# EasyEDA Pro project ProPrj_M-power_2025-07-25.epro, schematic 电源

## Sheets
1 功率: Board Name: Board1; Create Date: 2025-06-16; Page Name: 功率; Project Name: M-power; Schematic Name: 电源; Update Date: 2025-07-17; Company: 嘉立创EDA; Page Size: A4; Version: V1.1
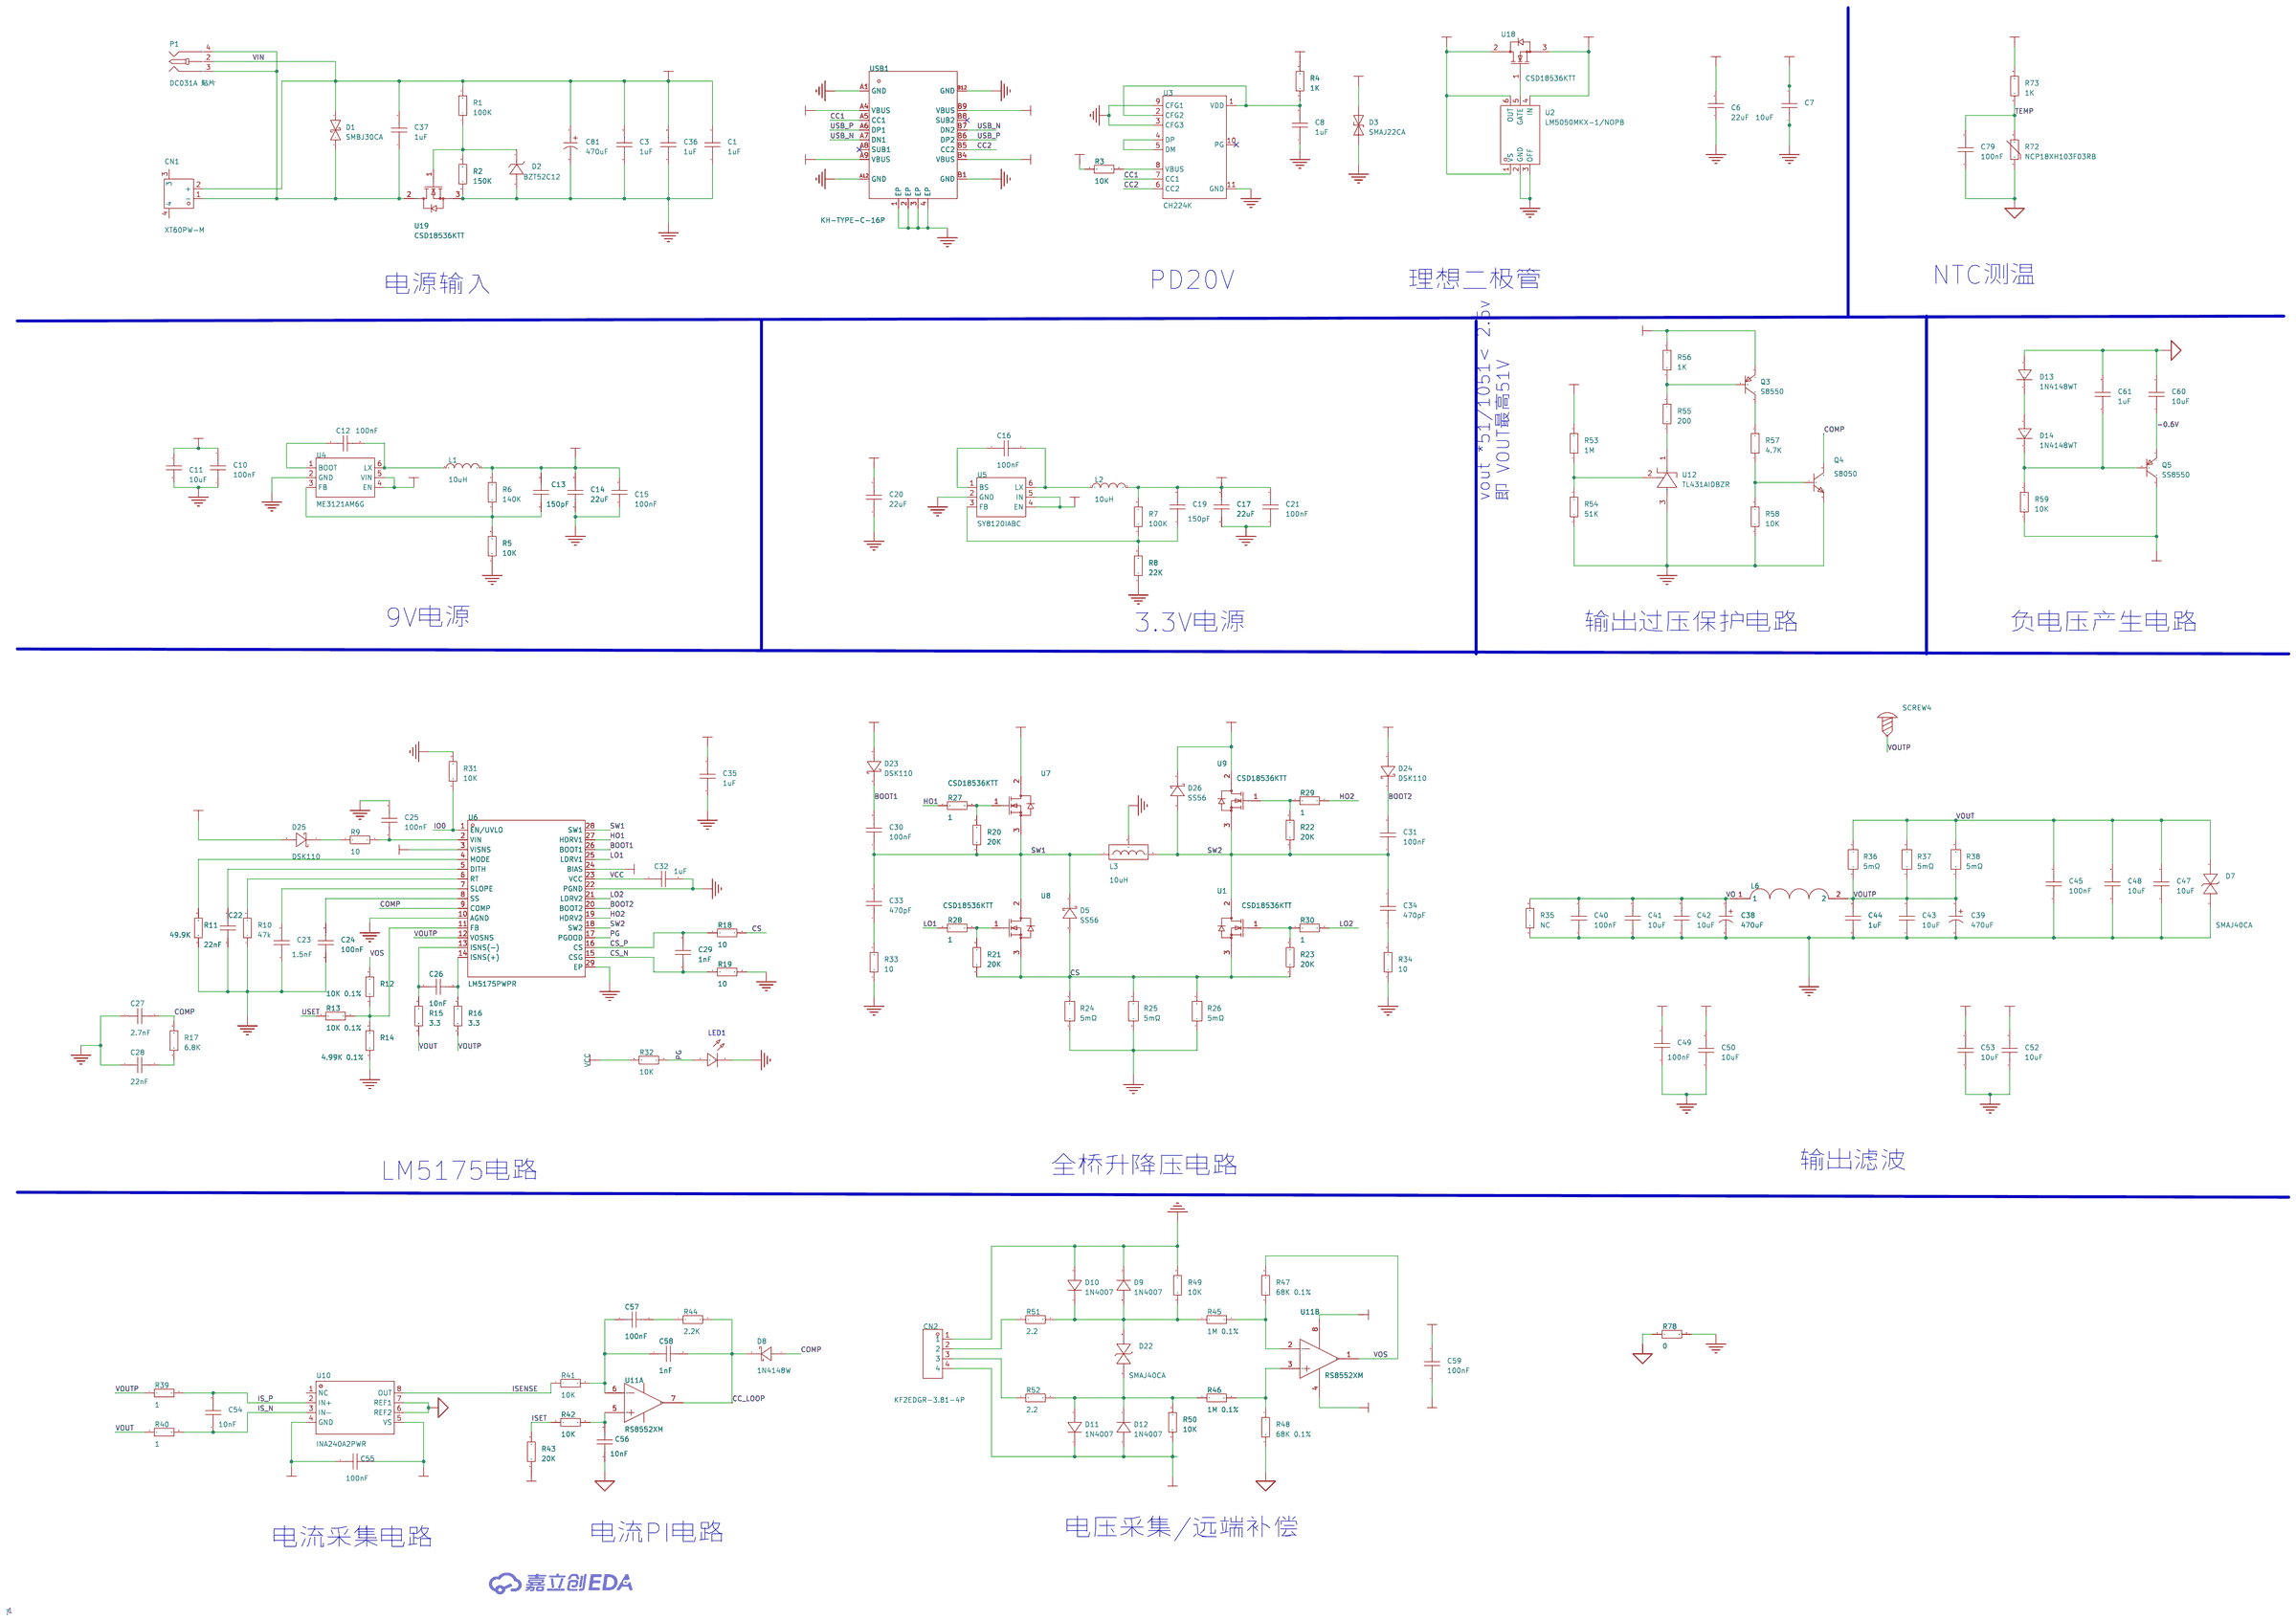
[diagram p0: 功率]
2 控制: Page Name: 控制; Update Date: 2025-07-18; Version: V1.0
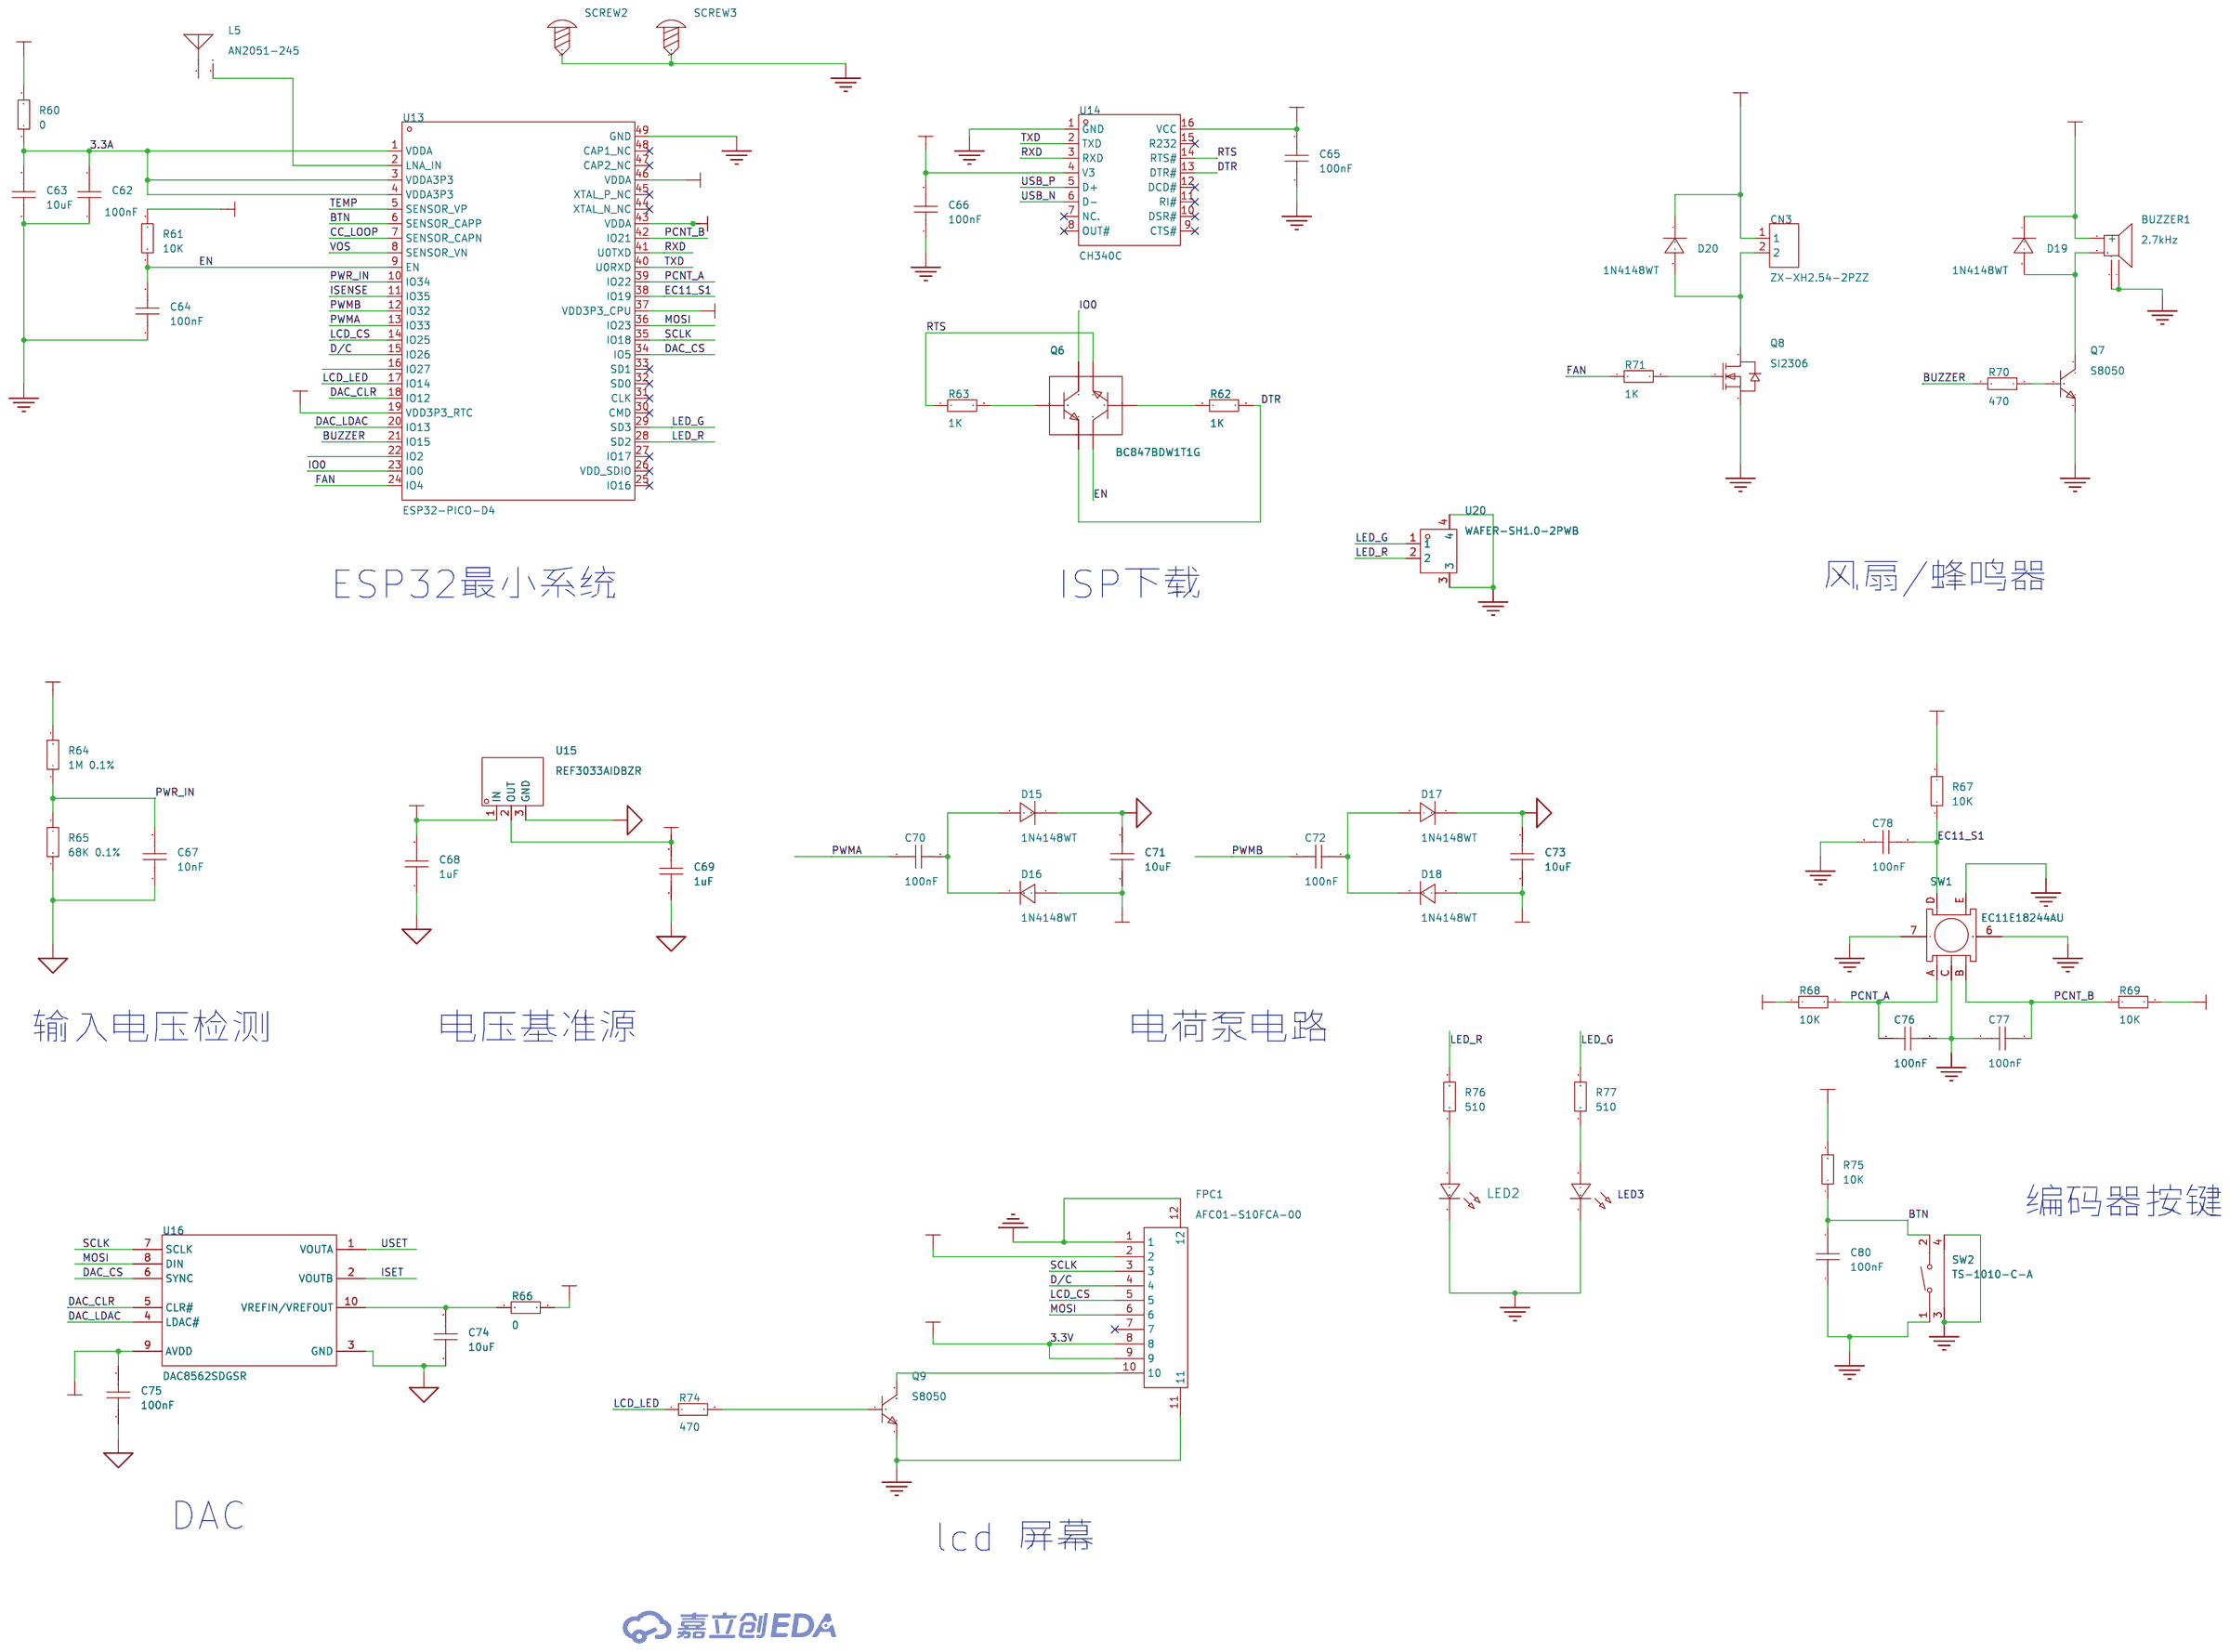
[diagram p1: 控制]

## Parts
sheet 功率
C1  1uF  [C1206]
C3  1uF  [C1206]
C6  22uF  [C1206]
C7  10uF  [C1206]
C8  1uF  [C0603]
C10  100nF  [C0603]
C11  10uF  [C1206]
C12  100nF  [C0603]
C13  150pF  [C0603]
C14  22uF  [C0805]
C15  100nF  [C0603]
C16  100nF  [C0603]
C17  22uF  [C0603]
C19  150pF  [C0603]
C20  22uF  [C0603]
C21  100nF  [C0603]
C22  22nF  [C0603]
C23  1.5nF  [C0603]
C24  100nF  [C0603]
C25  100nF  [C0603]
C26  10nF  [C0603]
C27  2.7nF  [C0603]
C28  22nF  [C0603]
C29  1nF  [C0603]
C30  100nF  [C0603]
C31  100nF  [C0603]
C32  1uF  [C0603]
C33  470pF  [C0603]
C34  470pF  [C0603]
C35  1uF  [C0603]
C36  1uF  [C1206]
C37  1uF  [C1206]
C38  470uF  [CAP-TH_BD10.0-P5.00-D0.6-FD-A]
C39  470uF  [CAP-TH_BD10.0-P5.00-D0.6-FD-A]
C40  100nF  [C0603]
C41  10uF  [C1206]
C42  10uF  [C1206]
C43  10uF  [C1206]
C44  1uF  [C1206]
C45  100nF  [C0603]
C47  10uF  [C1206]
C48  10uF  [C1206]
C49  100nF  [C0603]
C50  10uF  [C1206]
C52  10uF  [C1206]
C53  10uF  [C1206]
C54  10nF  [C0603]
C55  100nF  [C0603]
C56  10nF  [C0603]
C57  100nF  [C0603]
C58  1nF  [C0603]
C59  100nF  [C0603]
C60  10uF  [C0603]
C61  1uF  [C0603]
C79  100nF  [C0603]
C81  470uF  [CAP-TH_BD10.0-P5.00-D0.6-FD-A]
CN1  XT60PW-M  [CONN-TH_XT60PW-M]
CN2  KF2EDGR-3.81-4P  [CONN-TH_4P-P3.81_KF2EDGR-3.81-4P]
D1  SMBJ30CA  [SMB_L4.6-W3.6-LS5.3-BI]
D2  BZT52C12  [SOD-123_L2.7-W1.6-LS3.7-RD]
D3  SMAJ22CA  [SMA_L4.4-W2.6-LS5.0-BI]
D5  SS56  [SMA_L4.3-W2.6-LS5.0-RD]
D7  SMAJ40CA  [SMA_L4.3-W2.6-LS5.0-BI]
D8  1N4148W  [SOD-123_L2.7-W1.6-LS3.7-FD]
D9  1N4007  [SMA_L4.3-W2.5-LS5.0-RD]
D10  1N4007  [SMA_L4.3-W2.5-LS5.0-RD]
D11  1N4007  [SMA_L4.3-W2.5-LS5.0-RD]
D12  1N4007  [SMA_L4.3-W2.5-LS5.0-RD]
D13  1N4148WT  [SOD-523_L1.2-W0.8-LS1.6-RD]
D14  1N4148WT  [SOD-523_L1.2-W0.8-LS1.6-RD]
D22  SMAJ40CA  [SMA_L4.3-W2.6-LS5.0-BI]
D23  DSK110  [SOD-123FL_L2.8-W1.9-LS3.7-RD]
D24  DSK110  [SOD-123FL_L2.8-W1.9-LS3.7-RD]
D25  DSK110  [SOD-123FL_L2.8-W1.9-LS3.7-RD]
D26  SS56  [SMA_L4.3-W2.6-LS5.0-RD]
L1  10uH  [IND-SMD_L7.0-W6.6_FXL0630]
L2  10uH  [IND-SMD_L7.3-W6.8]
L3  10uH  [IND-SMD_3P-L28.0-W19.4_7443641000B]
L6  -  [2.2uh磁棒]
LED1  -  [LED_0603]
P1  DC031A 贴片  [DC-IN-SMD_DC031A]
Q3  S8550  [SOT-23-3_L2.9-W1.3-P1.90-LS2.4-BR]
Q4  S8050  [SOT-23-3_L2.9-W1.3-P1.90-LS2.3-BR]
Q5  SS8550  [SOT-23-3_L2.9-W1.3-P1.90-LS2.4-BR]
R1  100K  [R0603]
R2  150K  [R0603]
R3  10K  [R0603]
R4  1K  [R0603]
R5  10K  [R0603]
R6  140K  [R0603]
R7  100K  [R0603]
R8  22K  [R0603]
R9  10  [R0603]
R10  47k  [R0603]
R11  49.9K  [R0603]
R12  10K 0.1%  [R0603]
R13  10K 0.1%  [R0603]
R14  4.99K 0.1%  [R0603]
R15  3.3  [R0603]
R16  3.3  [R0603]
R17  6.8K  [R0603]
R18  10  [R0603]
R19  10  [R0603]
R20  20K  [R0603]
R21  20K  [R0603]
R22  20K  [R0603]
R23  20K  [R0603]
R24  5mΩ  [R2512]
R25  5mΩ  [R2512]
R26  5mΩ  [R2512]
R27  1  [R0603]
R28  1  [R0603]
R29  1  [R0603]
R30  1  [R0603]
R31  10K  [R0603]
R32  10K  [R0603]
R33  10  [R0603]
R34  10  [R0603]
R35  NC  [R0603]
R36  5mΩ  [R2512]
R37  5mΩ  [R2512]
R38  5mΩ  [R2512]
R39  1  [R0603]
R40  1  [R0603]
R41  10K  [R0603]
R42  10K  [R0603]
R43  20K  [R0603]
R44  2.2K  [R0603]
R45  1M 0.1%  [R0603]
R46  1M 0.1%  [R0603]
R47  68K 0.1%  [R0603]
R48  68K 0.1%  [R0603]
R49  10K  [R0603]
R50  10K  [R0603]
R51  2.2  [R0603]
R52  2.2  [R0603]
R53  1M  [R0603]
R54  51K  [R0603]
R55  200  [R0603]
R56  1K  [R0603]
R57  4.7K  [R0603]
R58  10K  [R0603]
R59  10K  [R0603]
R72  NCP18XH103F03RB  [R0603]
R73  1K  [R0603]
R78  0  [R0603]
SCREW4  -  [M2螺丝]
U1  CSD18536KTT  [TO-263-3_L10.4-W10.1-P5.08-LS15.4-BRM]
U2  LM5050MKX-1/NOPB  [TSOT-23-6_L2.9-W1.6-P0.95-LS2.8-BL]
U3  CH224K  [ESSOP-10_L4.9-W3.9-P1.0-LS6.0-TL-EP]
U4  ME3121AM6G  [SOT-23-6_L2.9-W1.6-P0.95-LS2.8-BR]
U5  SY8120IABC  [SOT-23-6_L2.9-W1.6-P0.95-LS2.8-BL]
U6  LM5175PWPR  [HTSSOP-28_L9.8-W4.5-P0.65-LS6.6-BL-EP]
U7  CSD18536KTT  [TO-263-3_L10.4-W10.1-P5.08-LS15.4-BRM]
U8  CSD18536KTT  [TO-263-3_L10.4-W10.1-P5.08-LS15.4-BRM]
U9  CSD18536KTT  [TO-263-3_L10.4-W10.1-P5.08-LS15.4-BRM]
U10  INA240A2PWR  [TSSOP-8_L4.4-W3.0-P0.65-LS6.4-BL]
U11  RS8552XM  [MSOP-8_L3.0-W3.0-P0.65-LS4.9-BL]  (sections 1,2)
U12  TL431AIDBZR  [SOT-23-3_L2.9-W1.6-P1.90-LS2.8-BR]
U18  CSD18536KTT  [TO-263-3_L10.4-W10.1-P5.08-LS15.4-BRM]
U19  CSD18536KTT  [TO-263-3_L10.4-W10.1-P5.08-LS15.4-BRM]
USB1  KH-TYPE-C-16P  [USB-C-SMD_KH-TYPE-C-16P]
sheet 控制
BUZZER1  2.7kHz  [BUZ-SMD_4P-L8.5-W8.5-P8.50-BR]
C62  100nF  [C0603]
C63  10uF  [C0603]
C64  100nF  [C0603]
C65  100nF  [C0603]
C66  100nF  [C0603]
C67  10nF  [C0603]
C68  1uF  [C0603]
C69  1uF  [C0603]
C70  100nF  [C0603]
C71  10uF  [C0603]
C72  100nF  [C0603]
C73  10uF  [C0603]
C74  10uF  [C0603]
C75  100nF  [C0603]
C76  100nF  [C0603]
C77  100nF  [C0603]
C78  100nF  [C0603]
C80  100nF  [C0603]
CN3  ZX-XH2.54-2PZZ  [CONN-TH_2P-P2.50_HX25003-2A]
D15  1N4148WT  [SOD-523_L1.2-W0.8-LS1.6-RD]
D16  1N4148WT  [SOD-523_L1.2-W0.8-LS1.6-RD]
D17  1N4148WT  [SOD-523_L1.2-W0.8-LS1.6-RD]
D18  1N4148WT  [SOD-523_L1.2-W0.8-LS1.6-RD]
D19  1N4148WT  [SOD-523_L1.2-W0.8-LS1.6-RD]
D20  1N4148WT  [SOD-523_L1.2-W0.8-LS1.6-RD]
FPC1  AFC01-S10FCA-00  [FPC-SMD_P0.5-10P_FGS-XJ-H2.0]
L5  AN2051-245  [ANT2051]
LED2  -  [LED_0603]
LED3  -  [LED_0603]
Q6  BC847BDW1T1G  [SOT-363_L2.0-W1.3-P0.65-LS2.1-TL]
Q7  S8050  [SOT-23-3_L2.9-W1.3-P1.90-LS2.3-BR]
Q8  SI2306  [SOT-23-3_L2.9-W1.4-P1.91-LS2.6-BR]
Q9  S8050  [SOT-23-3_L2.9-W1.3-P1.90-LS2.3-BR]
R60  0  [R0603]
R61  10K  [R0603]
R62  1K  [R0603]
R63  1K  [R0603]
R64  1M 0.1%  [R0603]
R65  68K 0.1%  [R0603]
R66  0  [R0603]
R67  10K  [R0603]
R68  10K  [R0603]
R69  10K  [R0603]
R70  470  [R0603]
R71  1K  [R0603]
R74  470  [R0603]
R75  10K  [R0603]
R76  510  [R0603]
R77  510  [R0603]
SCREW2  -  [M2螺丝]
SCREW3  -  [M2螺丝]
SW1  EC11E18244AU  [SW-TH_EC11XXXXXXXX]
SW2  TS-1010-C-A  [KEY-SMD_TX-1010-X-X]
U13  ESP32-PICO-D4  [LGA-48_L7.0-W7.0-P0.50-BL-EP5.4]
U14  CH340C  [SOP-16_L10.0-W3.9-P1.27-LS6.0-BL]
U15  REF3033AIDBZR  [SOT-23-3_L3.0-W1.7-P0.95-LS2.9-BR]
U16  DAC8562SDGSR  [VSSOP-10_L3.0-W3.0-P0.50-LS4.9-BL]
U20  WAFER-SH1.0-2PWB  [CONN-SMD_2P-P1.00_XUNPU_WAFER-SH1.0-2PWB]

## Library data of the parts
C1 C3 C36 C37 C41-C44 C47 C48 C50 C52 C53 = CL31B105KBHNNNE: 容值:1uF;精度:±10%;额定电压:50V;材质(温度系数):X7R;; LCSC Part Name: 1uF ±10% 50V; Supplier Part: C1848; Manufacturer: SAMSUNG(三星); Supplier Footprint: 1206; JLCPCB Part Class: Basic Part; Datasheet: https://atta.szlcsc.com/upload/public/pdf/source/20160218/1457707763339.pdf; Supplier: LCSC; Tolerance: ±10%; Voltage Rated: 50V; Temperature Coefficient: X7R
C6 = CL31A226KAHNNNE: 容值:22uF;精度:±10%;额定电压:25V;材质(温度系数):X5R;; LCSC Part Name: 22uF ±10% 25V; Supplier Part: C12891; Manufacturer: SAMSUNG(三星); Supplier Footprint: 1206; JLCPCB Part Class: 基础库; Datasheet: https://atta.szlcsc.com/upload/public/pdf/source/20160218/1457707763339.pdf; Supplier: LCSC; Tolerance: ±10%; Voltage Rated: 25V; Temperature Coefficient: X5R
C7 = CL10A106MA8NRNC: 容值:10uF;精度:±20%;额定电压:25V;材质(温度系数):X5R;; LCSC Part Name: 10uF ±20% 25V; Supplier Part: C96446; Manufacturer: SAMSUNG(三星); Supplier Footprint: 0603; JLCPCB Part Class: 基础库; Datasheet: https://atta.szlcsc.com/upload/public/pdf/source/20160218/1457707763339.pdf; Supplier: LCSC; Tolerance: ±20%; Voltage Rated: 25V; Temperature Coefficient: X5R
C8 C10 C12 C13 C16 C19 C21-C35 C40 C45 C49 C54-C80 = CAP_0603: Supplier Footprint: 0603
C11 = CL31A106KBHNNNE: 容值:10uF;精度:±10%;额定电压:50V;材质(温度系数):X5R;; LCSC Part Name: 10uF ±10% 50V; Supplier Part: C13585; Manufacturer: SAMSUNG(三星); Supplier Footprint: 1206; JLCPCB Part Class: 基础库; Datasheet: https://atta.szlcsc.com/upload/public/pdf/source/20160218/1457707763339.pdf; Supplier: LCSC; Tolerance: ±10%; Voltage Rated: 50V; Temperature Coefficient: X5R
C14 = CL21A226MAYNNNE: 容值:22uF;精度:±20%;额定电压:25V;材质(温度系数):X5R;; LCSC Part Name: 22uF ±20% 25V; Supplier Part: C602037; Manufacturer: SAMSUNG(三星); Supplier Footprint: 0805; JLCPCB Part Class: 扩展库; Datasheet: https://atta.szlcsc.com/upload/public/pdf/source/20200609/C602037_1A0D619693E608A1BF6E80154254E2DB.pdf; Supplier: LCSC; Tolerance: ±20%; Voltage Rated: 25V; Temperature Coefficient: X5R
C15 = CL31A107MQHNNNE: 容值:100uF;精度:±20%;额定电压:6.3V;材质(温度系数):X5R;; LCSC Part Name: 100uF ±20% 6.3V; Supplier Part: C15008; Manufacturer: SAMSUNG(三星); Supplier Footprint: 1206; JLCPCB Part Class: 基础库; Datasheet: https://atta.szlcsc.com/upload/public/pdf/source/20160218/1457707763339.pdf; Supplier: LCSC; Tolerance: ±20%; Voltage Rated: 6.3V; Temperature Coefficient: X5R
C17 C20 = CL10A226MQ8NRNC: 容值:22uF;精度:±20%;额定电压:6.3V;材质(温度系数):X5R;; LCSC Part Name: 22uF ±20% 6.3V; Supplier Part: C59461; Manufacturer: SAMSUNG(三星); Supplier Footprint: 0603; JLCPCB Part Class: 基础库; Datasheet: https://atta.szlcsc.com/upload/public/pdf/source/20160218/1457707763339.pdf; Supplier: LCSC; Tolerance: ±20%; Voltage Rated: 6.3V; Temperature Coefficient: X5R
C38 C39 C81 = PA50V470M10x17: 容值:470uF;精度:±20%;额定电压:50V;纹波电流:4.1A@100Hz;等效串联电阻(ESR):18mΩ@100kHz;类型:-;; LCSC Part Name: 470uF ±20% 50V; Supplier Part: C46550425; Manufacturer: 捷而瑞; Supplier Footprint: 插件,D10xL17mm; JLCPCB Part Class: 扩展库; Datasheet: https://atta.szlcsc.com/upload/public/pdf/source/20250307/831193F737CAF6D75AC25F14E955F0EC.pdf; Supplier: LCSC; Tolerance: ±20%; Voltage Rating: 50V; Ripple Current: 4.1A@100Hz; Equivalent Series Resistance(ESR): 18mΩ@100kHz; Diameter: 10mm; Height - Seated (Max): 17mm; Lifetime: 2000hrs@105℃; Operating Temperature: -55℃~+105℃
CN1 = XT60PW-M: 类别:-;类型1:-;; LCSC Part Name: AMASS(艾迈斯)航模插头xt60连接器150公母对接pw锂电池公头 板插卧式XT60PW-M; Supplier Part: C98732; Manufacturer: AMASS(艾迈斯); JLCPCB Part Class: 扩展库; Datasheet: https://atta.szlcsc.com/upload/public/pdf/source/20240118/44A3DCFF53BE25DC65378AFFB21277A4.pdf; Supplier: LCSC; Brand: 艾迈斯; Type: 卧式插头; Colour: 黄色; InterfaceType: 公头
CN2 = KF2EDGR-3.81-4P: 连接器类型:板端/插座-闭口;结构:1x4P;间距:3.81mm;颜色:绿色;安装方式:弯针;排数:1;每排PIN数:4;额定电流:8A;额定电压:300V;工作温度范围:-40℃~+105℃;; LCSC Part Name: 3.81mm 1x4P 排数:1 每排P数:4; Supplier Part: C441184; Manufacturer: KEFA(科发); Supplier Footprint: 弯插,P=3.81mm; JLCPCB Part Class: 扩展库; Datasheet: https://atta.szlcsc.com/upload/public/pdf/source/20230331/6258E6C6BF04EFF922F3E5A9E72A4547.pdf; Supplier: LCSC; Connector Type: 板端/插座-闭口; Structure: 1x4P; Pitch: 3.81mm; Color: 绿色; Mounting Style: 弯针; Number of Pins: 4P; Number of Rows: 1; Number of PINs Per Row: 4; Current Rating (Max): 8A; Voltage Rating (Max): 300V; Operating Temperature Range: -40℃~+105℃
D1 = SMBJ30CA_C113999: 反向截止电压(Vrwm):30V;最大钳位电压:48.4V;峰值脉冲电流(Ipp)@10/1000us:12.4A;击穿电压:33.3V;; LCSC Part Name: 双向 Vrwm:30V; Supplier Part: C113999; Manufacturer: MDD; Supplier Footprint: SMB(DO-214AA); JLCPCB Part Class: 扩展库; Datasheet: https://atta.szlcsc.com/upload/public/pdf/source/20230314/C8F66EF07395B88C11214ABD10019202.pdf; Supplier: LCSC; Reverse Stand-Off Voltage (Vrwm): 30V; Maximum Clamping Voltage: 48.4V; Peak Pulse Current (Ipp)@10/1000us: 12.4A; Breakdown Voltage: 33.3V; Type: TVS
D2 = BZT52C12_C19077410: 二极管配置:独立式;稳压值(标称值):12V;稳压值(范围):11.4V~12.6V;功率(Pd):500mW;; Supplier Part: C19077410; Manufacturer: 宏迦橙; Supplier Footprint: SOD-123; JLCPCB Part Class: 扩展库; Datasheet: https://atta.szlcsc.com/upload/public/pdf/source/20241104/A31DF82E6D0CBEC29199D0B62829516E.pdf; Supplier: LCSC; Diode Configuration: 独立式; Zener Voltage (Nom): 12V; Reverse Leakage Current (Ir): 100nA@8V; Zener Voltage (Range): 11.4V~12.6V; Power Dissipation: 500mW; Zener Impedance (Zzt): 25Ω
D3 = SMAJ22CA_C148221: 反向截止电压(Vrwm):22V;最大钳位电压:35.5V;峰值脉冲电流(Ipp):11.3A;峰值脉冲功率(Ppp):400W;击穿电压:24.4V;; LCSC Part Name: 反向截止电压(Vrwm) 22 击穿电压(V) 24.40; Supplier Part: C148221; Manufacturer: Littelfuse(美国力特); Supplier Footprint: SMA(DO-214AC); JLCPCB Part Class: 扩展库; Datasheet: https://atta.szlcsc.com/upload/public/pdf/source/20190402/C374025_5ACE77BC72947DF13CF0CBC7F8B57228.pdf; Supplier: LCSC; Reverse Stand-Off Voltage (Vrwm): 22V; Maximum Clamping Voltage: 35.5V; Peak Pulse Current (Ipp): 11.3A; Peak Pulse Power Dissipation (Ppp): 400W; Breakdown Voltage: 24.4V; Type: TVS
D5 D26 = SS56_C18199169: 二极管配置:独立式;正向压降(Vf):700mV@5.0A;直流反向耐压(Vr):60V;整流电流:5A;; LCSC Part Name: 电压:60V 电流:5A; Supplier Part: C18199169; Manufacturer: 宏迦橙; Supplier Footprint: SMA(DO-214AC); JLCPCB Part Class: 扩展库; Datasheet: https://atta.szlcsc.com/upload/public/pdf/source/20230828/254C3882F8647358AD9F60DD73611B5E.pdf; Supplier: LCSC; Diode Configuration: 独立式; Forward Voltage (Vf@If): 700mV@5.0A; Reverse Voltage (Vr): 60V; Rectified Current: 5A; Reverse Leakage Current (Ir): 200uA@60V
D7 D22 = SMAJ40CA_C19077552: 极性:双向;反向截止电压(Vrwm):40V;钳位电压:64.5V;峰值脉冲电流(Ipp):6.2A;峰值脉冲功率(Ppp):400W;击穿电压:44.4V;; Supplier Part: C19077552; Manufacturer: 宏嘉诚; Supplier Footprint: SMA; JLCPCB Part Class: 扩展库; Datasheet: https://atta.szlcsc.com/upload/public/pdf/source/20250107/539D2DC1EE5F9F3FCEFE35DA61E92AD9.pdf; Supplier: LCSC; Polarity: 双向; Reverse Stand-Off Voltage (Vrwm): 40V; Clamping Voltage: 64.5V; Peak Pulse Current (Ipp): 6.2A; Peak Pulse Power Dissipation (Ppp): 400W; Voltage - Breakdown: 44.4V; Reverse Leakage Current (Ir): 1uA; Number of Channels: 单路; Type: TVS
D8 = 1N4148W_C7420318: 二极管配置:独立式;正向压降(Vf):1.25V@150mA;直流反向耐压(Vr):100V;整流电流:150mA;反向恢复时间(trr):4ns;; Supplier Part: C7420318; Manufacturer: 宏迦橙; Supplier Footprint: SOD-123; JLCPCB Part Class: 扩展库; Datasheet: https://atta.szlcsc.com/upload/public/pdf/source/20230828/E5C3F7A4272052930A7E03B75759BF50.pdf; Supplier: LCSC; Diode Configuration: 独立式; Forward Voltage (Vf@If): 1.25V@150mA; Reverse Voltage (Vr): 100V; Rectified Current: 150mA; Reverse Leakage Current (Ir): 1uA@75V; Reverse Recovery Time (trr): 4ns; Operating Temperature: -55℃~+150℃
D9-D12 = 1N4007_C727081: 二极管配置:独立式;正向压降(Vf):1.1V@1A;直流反向耐压(Vr):1kV;整流电流:1A;; Supplier Part: C727081; Manufacturer: TWGMC(台湾迪嘉); Supplier Footprint: SMA(DO-214AC); JLCPCB Part Class: 扩展库; Datasheet: https://atta.szlcsc.com/upload/public/pdf/source/20200828/C727079_3A05254382567072883400655AE0ED46.pdf; Supplier: LCSC; Diode Configuration: 独立式; Forward Voltage (Vf@If): 1.1V@1A; Reverse Voltage (Vr): 1kV; Rectified Current: 1A; Reverse Leakage Current (Ir): 5uA
D13-D20 = 1N4148WT_C232841: 二极管配置:独立式;正向压降(Vf):1V@10mA;直流反向耐压(Vr):75V;整流电流:300mA;反向恢复时间(trr):4ns;; LCSC Part Name: 电压:75V 电流:300mA; Supplier Part: C232841; Manufacturer: onsemi(安森美); Supplier Footprint: SOD-523F; JLCPCB Part Class: 扩展库; Datasheet: https://atta.szlcsc.com/upload/public/pdf/source/20181222/C232841_42C5BA49E5A441BB8F6B91D0F4CD0D51.pdf; Supplier: LCSC; Diode Configuration: 独立式; Forward Voltage (Vf@If): 1V@10mA; Reverse Voltage (Vr): 75V; Rectified Current: 300mA; Reverse Leakage Current: 5uA@75V; Reverse Recovery Time (trr): 4ns; Operating Temperature: -55℃~+150℃@(Tj)
D23-D25 = DSK110_C22466354: 二极管配置:独立式;正向压降(Vf):850mV@1A;直流反向耐压(Vr):100V;整流电流:1A;; LCSC Part Name: 电压:100V 电流:1A; Supplier Part: C22466354; Manufacturer: 宏迦橙; Supplier Footprint: SOD-123FL; JLCPCB Part Class: 扩展库; Datasheet: https://atta.szlcsc.com/upload/public/pdf/source/20240814/38CD25CB8CE91BC83D23164D521560FD.pdf; Supplier: LCSC; Diode Configuration: 独立式; Forward Voltage (Vf@If): 850mV@1A; Reverse Voltage (Vr): 100V; Rectified Current: 1A; Reverse Leakage Current (Ir): 50uA@100V
L1 = FXL0630-330-M: 电感值:33uH;精度:±20%;额定电流:2A;饱和电流(Isat):2.5A;类型:一体成型电感;; LCSC Part Name: 33uH ±20% 2.5A; Supplier Part: C177245; Manufacturer: cjiang(长江微电); Supplier Footprint: SMD,6.6x7mm; JLCPCB Part Class: 扩展库; Datasheet: https://atta.szlcsc.com/upload/public/pdf/source/20240426/3189EA8206330E2108542F9E34E540E7.pdf; Supplier: LCSC; Tolerance: ±20%; Rated Current: 2A; Saturation Current (Isat): 2.5A; DC Resistance (DCR): 310mΩ; Type: 一体成型电感
L2 = FXL0630-100-M: 电感值:10uH;精度:±20%;额定电流:4.5A;饱和电流(Isat):5.5A;类型:一体成型电感;; LCSC Part Name: 10uH ±20% 5.5A; Supplier Part: C167223; Manufacturer: cjiang(长江微电); Supplier Footprint: SMD,6.6x7mm; JLCPCB Part Class: 扩展库; Datasheet: https://atta.szlcsc.com/upload/public/pdf/source/20240426/3189EA8206330E2108542F9E34E540E7.pdf; Supplier: LCSC; Tolerance: ±20%; Rated Current: 4.5A; Saturation Current (Isat): 5.5A; DC Resistance (DCR): 68mΩ; Type: 一体成型电感
L3 = MTP2918S-100M: 电感值:10uH;精度:±20%;额定电流:30A;饱和电流(Isat):31A;类型:扁平线大电流电感;; LCSC Part Name: 10uH ±20% 31A; Supplier Part: C5361021; Manufacturer: COILMX(迈翔科技); Supplier Footprint: SMD,27x28mm; JLCPCB Part Class: 扩展库; Datasheet: https://atta.szlcsc.com/upload/public/pdf/source/20230605/41AABF1AD17ED7EDD13008F775C24B0E.pdf; Supplier: LCSC; Tolerance: ±20%; Rated Current: 30A; Saturation Current (Isat): 31A; DC Resistance (DCR): 2.5mΩ; Type: 扁平线大电流电感
L6 = 磁棒电感1.5uh
LED1 LED3 = LED_0603-G: Supplier Footprint: 0603
P1 = DC031A 贴片: 连接器类型:DC电源插座;安装方式:卧贴;触点内径:1.3mm;触点外径:3.7mm;额定电流:-;额定电压:-;工作温度范围:-;; LCSC Part Name: DC电源插座 内径:1.3mm 外径:3.7mm; Supplier Part: C52369; Manufacturer: BOOMELE(博穆精密); Supplier Footprint: SMD; JLCPCB Part Class: 扩展库; Datasheet: https://atta.szlcsc.com/upload/public/pdf/source/20181114/C52369_A772D3C87F930EA57FB4CD961A42242C.pdf; Supplier: LCSC; Connector Type: DC电源插座; Mounting Style: 卧贴; Inside Contact Diameter: 1.3mm; Outside Contact Diameter: 3.7mm
Q3 = S8550_C20069126: 晶体管类型:PNP;集电极电流(Ic):500mA;集射极击穿电压(Vceo):25V;耗散功率(Pd):300mW;直流电流增益(hFE):120@500mA,1.0V;; LCSC Part Name: hFE:200-350，丝印:2TY S8550; Supplier Part: C20069126; Manufacturer: 宏嘉诚; Supplier Footprint: SOT-23; JLCPCB Part Class: 扩展库; Datasheet: https://atta.szlcsc.com/upload/public/pdf/source/20250107/6DAD7E9AA702AA129A4A0106BAAB5F5A.pdf; Supplier: LCSC; type: PNP; Current - Collector(Ic): 500mA; Collector - Emitter Voltage VCEO: 25V; Pd - Power Dissipation: 300mW; DC Current Gain: 120@500mA,1.0V; Transition frequency(fT): 150MHz; Current - Collector Cutoff: 100nA; Vce Saturation(VCE(sat)): 500mV; Operating Temperature: -55℃~+150℃
Q4 Q7 Q9 = S8050_C20069125: 晶体管类型:NPN;集电极电流(Ic):500mA;集射极击穿电压(Vceo):25V;耗散功率(Pd):300mW;直流电流增益(hFE):120@50mA,1.0V;; LCSC Part Name: hFE:200-350，丝印:J3Y S8050; Supplier Part: C20069125; Manufacturer: 宏嘉诚; Supplier Footprint: SOT-23; JLCPCB Part Class: 扩展库; Datasheet: https://atta.szlcsc.com/upload/public/pdf/source/20250107/343E8B94B5C24D0D65D7D4B70E0B73F6.pdf; Supplier: LCSC; type: NPN; Current - Collector(Ic): 500mA; Collector - Emitter Voltage VCEO: 25V; Pd - Power Dissipation: 300mW; DC Current Gain: 120@50mA,1.0V; Transition frequency(fT): 100MHz; Current - Collector Cutoff: 100nA; Vce Saturation(VCE(sat)): 600mV; Operating Temperature: -55℃~+150℃
Q5 = SS8550_C7420371: 晶体管类型:PNP;集电极电流(Ic):1.5A;集射极击穿电压(Vceo):25V;耗散功率(Pd):300mW;直流电流增益(hFE):120@100mA,1.0V;; LCSC Part Name: H档 200-350; Supplier Part: C7420371; Manufacturer: 宏嘉诚; Supplier Footprint: SOT-23; JLCPCB Part Class: 扩展库; Datasheet: https://atta.szlcsc.com/upload/public/pdf/source/20250206/B381F69283527B7D099E47C96A9EDA59.pdf; Supplier: LCSC; type: PNP; Current - Collector(Ic): 1.5A; Collector - Emitter Voltage VCEO: 25V; Pd - Power Dissipation: 300mW; DC Current Gain: 120@100mA,1.0V; Transition frequency(fT): 100MHz; Current - Collector Cutoff: 100nA; Vce Saturation(VCE(sat)): 500mV; Operating Temperature: -55℃~+150℃
R1-R23 R27-R35 R39-R71 R73-R78 = Res_0603: Supplier Footprint: 0603
R24-R26 R36-R38 = JER2512F3R005: 电阻类型:采样电阻;阻值:5mΩ;精度:±1%;功率:3W;温度系数:±50ppm/℃;; LCSC Part Name: 5mΩ 3W 2512 ±1%; Supplier Part: C46634460; Manufacturer: 捷而瑞; Supplier Footprint: 2512; JLCPCB Part Class: 扩展库; Datasheet: https://atta.szlcsc.com/upload/public/pdf/source/20250318/D554CC95569B02A455FAE3D181D671EA.pdf; Supplier: LCSC; Type: 采样电阻; Tolerance: ±1%; Power(Watts): 3W; Temperature Coefficient: ±50ppm/℃
R72 = NCP18XH103F03RB: 阻值(25℃):10kΩ;B值(25℃/50℃):3380K;电阻精度:±1%;功率:100mW;B值精度:±1%;最大稳态电流(25℃):310uA;; LCSC Part Name: 10kΩ 电阻精度:±1% 3380K; Supplier Part: C13564; Manufacturer: muRata(村田); Supplier Footprint: 0603; JLCPCB Part Class: 扩展库; Datasheet: https://atta.szlcsc.com/upload/public/pdf/source/20130819/1457706638081.pdf; Supplier: LCSC; Resistance @ 25℃: 10kΩ; B Constant (25℃/50℃): 3380K; Resistance Tolerance: ±1%; B Constant (25℃/85℃): 3434K; B Constant (25℃/100℃): 3455K; Power: 100mW; B Constant Tolerance: ±1%; Steady State Current (Max): 310uA; Operating Temperature: -40℃~+125℃
SCREW2-SCREW4 = M2螺丝: Supplier Footprint: 插件
U1 U7-U9 U18 U19 = CSD18536KTT: 类型:1个N沟道;漏源电压(Vdss):60V;连续漏极电流(Id):200A;导通电阻(RDS(on)@Vgs,Id):1.6mΩ@100A,10V;功率(Pd):375W;阈值电压(Vgs(th)@Id):2.2V@250uA;; LCSC Part Name: 1个N沟道 耐压:60V 电流:200A; Supplier Part: C2861901; Manufacturer: TI(德州仪器); Supplier Footprint: TO-263-3; JLCPCB Part Class: 扩展库; Datasheet: https://www.ti.com/lit/ds/symlink/csd18536ktt.pdf; Supplier: LCSC; Type: 1个N沟道; Drain Source Voltage (Vdss): 60V; Continuous Drain Current (Id): 200A; Drain Source On Resistance (RDS(on)@Vgs,Id): 1.6mΩ@100A,10V; Power Dissipation (Pd): 375W; Gate Threshold Voltage (Vgs(th)@Id): 2.2V@250uA; Total Gate Charge (Qg@Vgs): 140nC@10V; Input Capacitance (Ciss@Vds): 11.43nF@30V; Operating Temperature: -55℃~+175℃@(Tj)
U2 = LM5050MKX-1/NOPB: LM5050-1 5V 至 75V、400uA IQ ORing FET 控制器; Supplier Part: C473393; Manufacturer: TI(德州仪器); Supplier Footprint: TSOT-23-6; JLCPCB Part Class: 扩展库; Datasheet: https://www.ti.com/cn/lit/gpn/lm5050-1; Supplier: LCSC
U3 = CH224K: LCSC Part Name: USBPD等多快充协议受电芯片CH224; Supplier Part: C970725; Manufacturer: WCH(南京沁恒); Supplier Footprint: ESSOP-10-150mil-1mm; JLCPCB Part Class: 扩展库; Datasheet: https://atta.szlcsc.com/upload/public/pdf/source/20240313/43C2AFDDBDD1F65B60386D2CCAB0811B.pdf; Supplier: LCSC
U4 = ME3121AM6G: 功能类型:降压型;输出类型:可调;工作电压:4.7V~40V;输出电压:-;输出电流:-;; LCSC Part Name: 40V输入1A负载同步整流降压DC-DC转换器; Supplier Part: C2932938; Manufacturer: MICRONE(南京微盟); Supplier Footprint: SOT-23-6; JLCPCB Part Class: 扩展库; Datasheet: https://atta.szlcsc.com/upload/public/pdf/source/20220331/EB46EBF6ED46F90696A7B4CB82ED1A1E.pdf; Supplier: LCSC; Function: 降压型; Output Type: 可调; Voltage - Supply: 4.7V~40V; Frequency - Switching: 1MHz; Operating Temperature: -40℃~+85℃; Synchronous Rectifier: 是; Number of Outputs: 1; Topology: 降压式; Quiescent Current: 120uA; Switch tube (built-in/external): 内置
U5 = SY8120IABC: 功能类型:降压型;输出类型:-;工作电压:4.2V~18V;输出电压:3.3V;输出电流:2A;; LCSC Part Name: 高效快速响应2A 18V输入同步降压稳压器; Supplier Part: C479076; Manufacturer: silergy(矽力杰); Supplier Footprint: SOT-23-6; JLCPCB Part Class: 扩展库; Datasheet: https://atta.szlcsc.com/upload/public/pdf/source/20200117/C479076_966579846AEBE0EBED34B944DFDE0A88.pdf; Supplier: LCSC; Function: 降压型; Voltage - Supply: 4.2V~18V; Output Voltage: 3.3V; Output Current: 2A; Frequency - Switching: 500kHz; Operating Temperature: -40℃~+125℃; Synchronous Rectifier: 是; Number of Outputs: 1; Topology: 降压式; Quiescent Current: 200uA; Switch tube (built-in/external): 内置
U6 = LM5175PWPR: 功能类型:升降压型;输出类型:-;工作电压:3.5V~42V;输出电压:-;输出电流:-;; Supplier Part: C113356; Manufacturer: TI(德州仪器); Supplier Footprint: HTSSOP-28-EP-4.5mm; JLCPCB Part Class: 扩展库; Datasheet: https://www.ti.com/cn/lit/gpn/lm5175; Supplier: LCSC; Function: 升降压型; Voltage - Supply: 3.5V~42V; Frequency - Switching: 600kHz; Operating Temperature: -40℃~+125℃@(TJ); Synchronous Rectifier: 是; Number of Outputs: 1; Topology: 降压-升压式
U10 = INA240A2PWR: 放大器数:单路;; Supplier Part: C129949; Manufacturer: TI(德州仪器); Supplier Footprint: TSSOP-8; JLCPCB Part Class: 扩展库; Datasheet: https://www.ti.com/cn/lit/gpn/ina240; Supplier: LCSC; Number of Channels: 单路; Supply Current: 1.8mA; Operating Temperature: -40℃~+125℃
U11 = RS8552XM: 放大器数:双路;增益带宽积(GBP):4.5MHz;压摆率(SR):2.5V/us;; Supplier Part: C236998; Manufacturer: RUNIC(润石); Supplier Footprint: MSOP-8; JLCPCB Part Class: 扩展库; Datasheet: https://atta.szlcsc.com/upload/public/pdf/source/20180704/C236998_2EA4A60C035D21B482DEA1E435D9107D.pdf; Supplier: LCSC; Number of Circuits: 双路; Gain Bandwidth Product(GBP): 4.5MHz; Slew Rate(SR): 2.5V/us; Supply Voltage: 2.7V~5.5V; Operating Temperature: -40℃~+125℃
U12 = TL431AIDBZR: 输出类型:可调;输入电压:-;输出电压:2.495V~36V;输出电流:100mA;精度:±1%;; Supplier Part: C23892; Manufacturer: TI(德州仪器); Supplier Footprint: SOT-23; JLCPCB Part Class: 扩展库; Datasheet: https://www.ti.com/cn/lit/gpn/tl431; Supplier: LCSC; Output Type: 可调; Output Voltage: 2.495V~36V; Output Current: 100mA; Tolerance: ±1%; Reference Type: 并联; Minimum Cathode Current for Regulation: 700uA; Operating Temperature: -40℃~+85℃@(Ta)
USB1 = KH-TYPE-C-16P: 连接器类型:Type-C;标准:-;公母:母;端口数量:1;触点数量:16P;安装方式:卧贴;额定电流 - 电源:3A;工作温度范围:-40℃~+85℃;; LCSC Part Name: Type-C 母 卧贴; Supplier Part: C709357; Manufacturer: kinghelm(金航标); Supplier Footprint: SMD; JLCPCB Part Class: 扩展库; Datasheet: https://atta.szlcsc.com/upload/public/pdf/source/20200911/C709357_AA8DCEB38BB20E3035A7ED7AE7667837.pdf; Supplier: LCSC; Connector Type: Type-C; Gender: 母; Number of Ports: 1; Number of Contacts: 16P; Mounting Style: 卧贴; Current Rating - Power (Max): 3A; Operating Temperature Range: -40℃~+85℃
BUZZER1 = MLT-8530_C94599: 驱动方式:无源(外部驱动);构造类型:电磁式;频率:2.7kHz;声压(SPL):80dB;; LCSC Part Name: MLT-8530; Supplier Part: C94599; Manufacturer: 华能; Manufacturer Part: MLT-8530; Supplier Footprint: SMD,8.5x8.5mm; JLCPCB Part Class: 扩展库; Datasheet: https://atta.szlcsc.com/upload/public/pdf/source/20170522/1495448322339.pdf; Supplier: LCSC; Driver Circuitry: 无源(外部驱动); Technology: 电磁式; Voltage - Supply: 2.5V~4.5V; Sound Pressure Level(SPL): 80dB; Length: 8.5mm; Width: 8.5mm; Height: 3.3mm
CN3 = ZX-XH2.54-2PZZ: 插针结构:1x2P;间距:2.5mm;安装方式:直插;参考系列:XH;总PIN数:2P;排数:1;每排PIN数:2;行距:-;额定电流:3A;触头材质:黄铜;触头镀层:锡;工作温度范围:-25℃~+85℃;; LCSC Part Name: 1x2P 间距:2.5mm 直插 系列:XH; Supplier Part: C7429632; Manufacturer: Megastar(兆星); Supplier Footprint: 插件,P=2.5mm; JLCPCB Part Class: 扩展库; Datasheet: https://atta.szlcsc.com/upload/public/pdf/source/20230619/19BA6947230AA44A04D3EDD65E618FD0.pdf; Supplier: LCSC; Pins Structure: 1x2P; Pitch: 2.5mm; Mounting Type: 直插; Reference Series: XH; Number of Pins: 2P; Number of Rows: 1; Number of PINs Per Row: 2; Rated Current: 3A; Contact Material: 黄铜; Contact Plating: 锡; Operating Temperature: -25℃~+85℃; Rated Voltage (Max): 250V; Plastic Material: PA66; Flame Retardant Rating: UL94V-0; Color: 白色; Z-Height of the Board: 7mm; X-Length of Bottom Edge on Board (Spacing Line): 7.5mm; Y-Width of Bottom Edge on Board: 5.9mm
FPC1 = AFC01-S10FCA-00: 锁定特性:翻盖式;触点类型:下接;触点数量:10P;间距:0.5mm;安装类型:卧贴;; LCSC Part Name: 间距:0.5mm P数:10P 翻盖式 下接; Supplier Part: C262659; Manufacturer: JS(钜硕电子); Supplier Footprint: SMD,P=0.5mm,卧贴; JLCPCB Part Class: 扩展库; Datasheet: https://atta.szlcsc.com/upload/public/pdf/source/20190816/C413942_2A72D1AC756EAE17EEDF756A339D4500.pdf; Supplier: LCSC; Locking Feature: 翻盖式; Contact Type: 下接; Number of Contacts: 10P; Pitch: 0.5mm; Mounting Type: 卧贴; FFC, FCB Thickness: 0.3mm; Height Above Board: 2mm
L5 = AN2051-245: 小体积，高增益，WIFI，蓝牙，zigBee 2.4G天线; Supplier Part: C99727; Manufacturer: rainsun(霖昱微); Supplier Footprint: SMD,2x5.1mm; JLCPCB Part Class: 扩展库; Datasheet: https://atta.szlcsc.com/upload/public/pdf/source/20170329/1490752053541.pdf; Supplier: LCSC
LED2 = LED_0603-R: Supplier Footprint: 0603
Q6 = BC847BDW1T1G: 晶体管类型:NPN;集电极电流(Ic):100mA;集射极击穿电压(Vceo):45V;功率(Pd):380mW;直流电流增益(hFE@Ic,Vce):150@10uA,5.0V;; LCSC Part Name: NPN 电流:100mA 耐压:45V; Supplier Part: C82368; Manufacturer: onsemi(安森美); Supplier Footprint: SOT-363; JLCPCB Part Class: 扩展库; Datasheet: https://atta.szlcsc.com/upload/public/pdf/source/20191129/C464115_39751988D575D2446DA0A13BA0A02B42.pdf; Supplier: LCSC; Transistor Type: NPN; Collector Current (Ic): 100mA; Collector-Emitter Breakdown Voltage (Vceo): 45V; Power Dissipation (Pd): 380mW; DC Current Gain (hFE@Ic,Vce): 150@10uA,5.0V; Transition Frequency (fT): 100MHz; Collector Cut-Off Current (Icbo): 5uA; Collector-Emitter Saturation Voltage (VCE(sat)@Ic,Ib): 250mV@10mA,0.5mA; Operating Temperature: -55℃~+150℃
Q8 = SI2306_C727154: 类型:1个N沟道;漏源电压(Vdss):30V;连续漏极电流(Id):3.16A;导通电阻(RDS(on)@Vgs,Id):47mΩ@10V,3.5A;功率:750mW;阈值电压(Vgs(th)@Id):3V@250uA;; LCSC Part Name: 1个N沟道 耐压:30V 电流:3.16A; Supplier Part: C727154; Manufacturer: TWGMC(台湾迪嘉); Supplier Footprint: SOT-23; JLCPCB Part Class: 扩展库; Datasheet: https://atta.szlcsc.com/upload/public/pdf/source/20200827/C727154_E3A89B00F5265460A6D78B8FA56EDAC6.pdf; Supplier: LCSC; Type: 1个N沟道; Drain Source Voltage (Vdss): 30V; Continuous Drain Current (Id): 3.16A; Drain Source On Resistance (RDS(on)@Vgs,Id): 47mΩ@10V,3.5A; Power Dissipation (Pd): 750mW; Gate Threshold Voltage (Vgs(th)@Id): 3V@250uA; Total Gate Charge (Qg@Vgs): 6nC@15V; Input Capacitance (Ciss@Vds): 305pF@15V; Reverse Transfer Capacitance (Crss@Vds): 29pF@15V; Operating Temperature: -55℃~+150℃
SW1 = EC11E18244AU: Supplier Part: C202365; Manufacturer: ALPSALPINE(阿尔卑斯阿尔派); Supplier Footprint: 插件; JLCPCB Part Class: 扩展库; Datasheet: https://atta.szlcsc.com/upload/public/pdf/source/20180403/C202365_70FA927E879F562641EADC151E1E414A.pdf; Supplier: LCSC
SW2 = TS-1010-C-A: 电路结构:单刀单掷;按钮形状:矩形按钮;作用力:260gf;安装方式:卧贴;开关长度:2.3mm;开关宽度:4.7mm;开关高度:3.5mm;带支架:不带;触点电流:50mA;额定电压(AC):-;额定电压(DC):12V;额定功率:-;绝缘电阻:-;带灯:无;机械寿命:10万次;; LCSC Part Name: 2.3*4.7*3.5mm 卧贴 轻触开关; Supplier Part: C692458; Manufacturer: XKB Connectivity(中国星坤); Supplier Footprint: SMD; JLCPCB Part Class: 扩展库; Datasheet: https://atta.szlcsc.com/upload/public/pdf/source/20211011/09621D275CE0F472C941775DFBBCCC96.pdf; Supplier: LCSC; Circuit: 单刀单掷; Actuator Style: 矩形按钮; Operating Force: 260gf; Mounting Style: 卧贴; Switch Length: 2.3mm; Switch Width: 4.7mm; Switch Height: 3.5mm; Strike Gundam: 不带; Contact Current: 50mA; Voltage Rating (DC): 12V; Actuator/Cap Color: 黑色; With Lamp: 无; Mechanical Life: 10万次; Operating Temperature: -30℃~+85℃
U13 = ESP32-PICO-D4: 频率范围:2.412GHz~2.484GHz;接口:I2C,SPI;应用领域:IoT；WiFi；蓝牙;数据速率:150Mbps;灵敏度:-97dBm;典型应用频率:2.4GHz;; LCSC Part Name: 集成2.4GHz WIFI和蓝牙的模组; Supplier Part: C193707; Manufacturer: ESPRESSIF(乐鑫); Supplier Footprint: QFN-48-EP(7x7); JLCPCB Part Class: 扩展库; Datasheet: https://atta.szlcsc.com/upload/public/pdf/source/20241030/D827B2F779C1E113D6FAEAB430963FEE.pdf; Supplier: LCSC; Frequency Range: 2.412GHz~2.484GHz; Interface: I2C,SPI; Operating Voltage: 2.7V~3.6V; Applications: IoT；WiFi；蓝牙; Output Power: 20dBm; Data Rate: 150Mbps; Sensitivity: -97dBm; Receive Current: 30mA; Typical Application Frequency: 2.4GHz; Operating Temperature: -40℃~+85℃
U14 = CH340C: 应用功能:收发器;接口协议:USB 2.0;数据速率:2Mbps;; Supplier Part: C84681; Manufacturer: WCH(南京沁恒); Supplier Footprint: SOP-16; JLCPCB Part Class: 扩展库; Datasheet: https://atta.szlcsc.com/upload/public/pdf/source/20240619/63986D8440D4E5267A77ACD891CC4DE3.pdf; Supplier: LCSC; Applications Function: 收发器; Protocol: USB 2.0; Voltage - Supply: 3.3V；5V; Data Rate: 2Mbps
U15 = REF3033AIDBZR: 输出类型:固定;输入电压:3.35V~5.5V;输出电压:3.3V;输出电流:25mA;精度:±0.2%;; Supplier Part: C36658; Manufacturer: TI(德州仪器); Supplier Footprint: SOT-23; JLCPCB Part Class: 扩展库; Datasheet: https://www.ti.com/cn/lit/gpn/ref3020; Supplier: LCSC; Output Type: 固定; Input Voltage: 3.35V~5.5V; Output Voltage: 3.3V; Output Current: 25mA; Tolerance: ±0.2%; Temperature Coefficient: 75ppm/℃; Reference Type: 串联; Supply Current: 50uA; Noise - 10Hz to 10kHz: 105uVrms; Operating Temperature: -40℃~+125℃@(Ta)
U16 = DAC8562SDGSR: DAC8562 具有 2.5V、4ppm/°C 基准的 16 位、双通道、低功耗、超低毛刺脉冲、电压输出 DAC; Supplier Part: C127965; Manufacturer: TI(德州仪器); Supplier Footprint: VSSOP-10-0.5mm; JLCPCB Part Class: 扩展库; Datasheet: https://www.ti.com/cn/lit/gpn/dac8562; Supplier: LCSC
U20 = WAFER-SH1.0-2PWB: 插针结构:1x2P;间距:1mm;安装方式:卧贴;参考系列:SH;总PIN数:2P;排数:1;每排PIN数:2;行距:-;额定电流:1A;触头材质:黄铜;触头镀层:-;工作温度:-25℃~+85℃;; LCSC Part Name: 1x2P 间距:1mm 卧贴 系列:SH; Supplier Part: C3029341; Manufacturer: XUNPU(讯普); Supplier Footprint: SMD,P=1mm,卧贴; JLCPCB Part Class: 扩展库; Datasheet: https://atta.szlcsc.com/upload/public/pdf/source/20220527/1879B8210BD3B2006BCEAC1A40D397B6.pdf; Supplier: LCSC; Pins Structure: 1x2P; Pitch: 1mm; Mounting Type: 卧贴; Reference Series: SH; Number of Pins: 2P; Number of Rows: 1; Number of PINs Per Row: 2; Current Rating: 1A; Contact Material: 黄铜; Operating Temperature: -25℃~+85℃; Voltage Rating: 50V; Plastic Material: LCP; Supplementary Features: 辅助焊脚; Color: 米色; Z-Height of the Board: 3.15mm; X-Length of Bottom Edge on Board (Spacing Line): 4.35mm; Y-Width of Bottom Edge on Board: 5.05mm

## Nets
3.3V: BUZZER1.1(+) C17.2 C19.2 C21.2 C55.2 C59.2 C65.2 C66.2 C68.2 C75.2 D19.1(C) FPC1.2 FPC1.8 FPC1.9 L2.2 Q3.2(E) R7.2 R56.1 R60.2 R61.2 R67.2 R68.1 R69.2 R73.2 R75.2 U10.5(VS) U11.8(V+) U14.4(V3) U14.16(VCC) U15.1(IN) U16.9(AVDD)
9V: C13.2 C14.2 C15.2 C20.2 C35.2 CN3.1 D20.1(C) L1.2 R6.2 U5.4(EN) U5.5(IN) U6.24(BIAS)
-0.6V: C55.1 C59.1 C60.1 Q5.2(E) R43.1 U10.4(GND) U11.4(V-)
-2V: C71.1 C73.1 D16.2(A) D18.2(A) Q5.3(C) R59.1
AGND: C56.1 C60.2 C61.2 C67.1 C68.1 C69.1 C71.2 C73.2 C74.1 C75.1 C79.1 D13.2(A) D15.1(C) D17.1(C) R48.2 R65.2 R72.1 R78.1 U10.6(REF2) U10.7(REF1) U15.3(GND) U16.3(GND)
GND: BUZZER1.3 BUZZER1.4 C1.1 C3.1 C6.1 C7.1 C8.1 C10.1 C11.1 C14.1 C15.1 C17.1 C20.1 C21.1 C22.1 C23.1 C24.1 C25.2 C27.1 C28.1 C32.2 C35.1 C36.1 C38.2 C39.2 C40.1 C41.1 C42.1 C43.1 C44.1 C45.1 C47.1 C48.1 C49.1 C50.1 C52.1 C53.1 C62.1 C63.1 C64.1 C65.1 C66.1 C76.2 C77.1 C78.1 C80.1 C81.2 CN2.1 D2.2(A) D3.1(K) D7.1 D9.1(K) D10.2(A) FPC1.1 FPC1.11 FPC1.12 L3.3 LED1.1(C) LED2.1(C) LED3.1(C) Q4.2(E) Q7.2(E) Q8.2(S) Q9.2(E) R2.1 R5.1 R8.1 R10.1 R11.1 R14.1 R19.2 R24.1 R25.1 R26.1 R31.2 R33.1 R34.1 R35.1 R49.1 R54.1 R58.1 R78.2 SCREW2.1 SCREW3.1 SW1.6 SW1.7 SW1.C SW1.E SW2.1 SW2.3 SW2.4 U2.2(GND) U2.3(OFF) U3.3(CFG3) U3.9(CFG1) U3.11(GND) U4.2(GND) U5.2(GND) U6.10(AGND) U6.22(PGND) U6.29(EP) U12.3(ANODE) U13.49(GND) U14.1(GND) U19.3(S) U20.3 U20.4 USB1.1(EP) USB1.2(EP) USB1.3(EP) USB1.4(EP) USB1.A1(GND) USB1.A12(GND) USB1.B1(GND) USB1.B12(GND)
VBUS: C6.2 D3.2(A) R3.1 R4.2 U2.4(IN) U18.3(S) USB1.A4(VBUS) USB1.A9(VBUS) USB1.B4(VBUS) USB1.B9(VBUS)
VCC: C32.1 D23.2(A) D24.2(A) R32.2 U6.23(VCC)
VIN: C1.2 C3.2 C7.2 C10.2 C11.2 C36.2 C37.2 C81.1 CN1.2(+) D1.2(A) D25.2(A) P1.2 R1.2 R64.2 U2.1(VS) U2.6(OUT) U4.4(EN) U4.5(VIN) U6.3(VISNS) U7.2(D) U18.2(D)
3.3A: C62.2 C63.2 R60.1 U13.1(VDDA) U13.3(VDDA3P3) U13.4(VDDA3P3) U13.19(VDD3P3_RTC) U13.37(VDD3P3_CPU) U13.43(VDDA) U13.46(VDDA)
BOOT1: C30.2 D23.1(K) U6.26(BOOT1)
BOOT2: C31.2 D24.1(K) U6.20(BOOT2)
BTN: C80.2 R75.1 SW2.2 U13.6(SENSOR_CAPP)
BUZZER: R70.1 U13.21(IO15)
CC1: U3.7(CC1) USB1.A5(CC1)
CC2: U3.6(CC2) USB1.B5(CC2)
CC_LOOP: C58.2 D8.2(K) R44.2 U11.7(OUT 2) U13.7(SENSOR_CAPN)
COMP: C27.2 D8.1(A) Q4.3(C) R17.2 U6.9(COMP)
CS: D5.2(A) R18.2 R21.1 R23.1 R24.2 R25.2 R26.2 U1.3(S) U8.3(S)
CS_N: C29.1 R19.1 U6.15(CSG)
CS_P: C29.2 R18.1 U6.16(CS)
D/C: FPC1.4 U13.15(IO26)
DAC_CLR: U13.18(IO12) U16.5(CLR#)
DAC_CS: U13.34(IO5) U16.6(SYNC)
DAC_LDAC: U13.20(IO13) U16.4(LDAC#)
DTR: Q6.4(E) R62.2 U14.13(DTR#)
EC11_S1: C78.2 R67.1 SW1.D U13.38(IO19)
EN: C64.2 Q6.6(C) R61.1 U13.9(EN)
FAN: R71.1 U13.24(IO4)
HO1: R27.1 U6.27(HDRV1)
HO2: R29.2 U6.19(HDRV2)
IO0: Q6.3(C) R31.1 U6.1(EN/UVLO) U13.23(IO0)
IS_N: C54.1 R40.2 U10.3(IN-)
IS_P: C54.2 R39.2 U10.2(IN+)
ISENSE: R41.1 U10.8(OUT) U13.11(IO35)
ISET: R42.1 R43.2 U16.2(VOUTB)
LCD_CS: FPC1.5 U13.14(IO25)
LCD_LED: R74.1 U13.17(IO14)
LED_G: R77.2 U13.29(SD3) U20.1
LED_R: R76.2 U13.28(SD2) U20.2
LO1: R28.1 U6.25(LDRV1)
LO2: R30.2 U6.21(LDRV2)
MOSI: FPC1.6 U13.36(IO23) U16.8(DIN)
PCNT_A: C76.1 R68.2 SW1.A U13.39(IO22)
PCNT_B: C77.2 R69.1 SW1.B U13.42(IO21)
PG: LED1.2(A) R32.1 U6.17(PGOOD)
PWMA: C70.1 U13.13(IO33)
PWMB: C72.1 U13.12(IO32)
PWR_IN: C67.2 R64.1 R65.1 U13.10(IO34)
RTS: Q6.1(E) R63.1 U14.14(RTS#)
RXD: U13.41(U0TXD) U14.3(RXD)
SCLK: FPC1.3 U13.35(IO18) U16.7(SCLK)
SW1: C30.1 C33.2 D5.1(K) L3.1 R20.1 U6.28(SW1) U7.3(S) U8.2(D)
SW2: C31.1 C34.2 D26.2(A) L3.2 R22.1 U1.2(D) U6.18(SW2) U9.3(S)
TEMP: C79.2 R72.2 R73.1 U13.5(SENSOR_VP)
TXD: U13.40(U0RXD) U14.2(TXD)
USB_N: U14.6(D-) USB1.A7(DN1) USB1.B7(DN2)
USB_P: U14.5(D+) USB1.A6(DP1) USB1.B6(DP2)
USET: R13.1 U16.1(VOUTA)
VO: C38.1 C40.2 C41.2 C42.2 C49.2 C50.2 D26.1(K) L6.1 R35.2 U9.2(D)
VOS: R12.2 R47.2 U11.1(OUT 1) U13.8(SENSOR_VN)
VOUT: C45.2 C47.2 C48.2 C52.2 C53.2 CN2.4 D7.2 D11.1(K) D12.2(A) R15.1 R36.2 R37.2 R38.2 R40.1 R50.2 R53.2
VOUTP: C39.1 C43.2 C44.2 L6.2 R16.1 R36.1 R37.1 R38.1 R39.1 SCREW4.1 U6.12(VOSNS)
VREF: C69.2 R66.2 U15.2(OUT)
$1N730: D2.1(K) R1.1 R2.2 U19.1(G)
$1N1359: C37.1 CN1.1(-) D1.1(K) P1.3 P1.4 U19.2(D)
$1N3275: U3.4(DP) U3.5(DM)
$1N4044: R3.2 U3.8(VBUS)
$1N4168: C8.2 R4.1 U3.1(VDD) U3.2(CFG2)
$1N4639: C12.1 U4.1(BOOT)
$1N4645: C12.2 L1.1 U4.6(LX)
$1N5570: C13.1 R5.2 R6.1 U4.3(FB)
$1N6323: C16.2 L2.1 U5.6(LX)
$1N6375: C16.1 U5.1(BS)
$1N6669: C19.1 R7.1 R8.2 U5.3(FB)
$1N9451: C25.1 R9.2 U6.2(VIN)
$1N9454: D25.1(K) R9.1
$1N9505: R11.2 U6.4(MODE)
$1N9510: C22.2 U6.5(DITH)
$1N9515: R10.2 U6.6(RT)
$1N9733: C23.2 U6.7(SLOPE)
$1N9801: C24.2 U6.8(SS)
$1N10134: R12.1 R13.2 R14.2 U6.11(FB)
$1N10218: C26.1 R15.2 U6.13(ISNS(-))
$1N10223: C26.2 R16.2 U6.14(ISNS(+))
$1N11987: C28.2 R17.1
$1N12802: R20.2 R27.2 U7.1(G)
$1N12843: R21.2 R28.2 U8.1(G)
$1N12896: R22.2 R29.1 U9.1(G)
$1N12937: R23.2 R30.1 U1.1(G)
$1N16340: C33.1 R33.2
$1N16344: C34.1 R34.2
$1N21011: C57.1 C58.1 R41.2 U11.6(-IN 2)
$1N21015: C56.2 R42.2 U11.5(+IN 2)
$1N21347: C57.2 R44.1
$1N24593: R45.2 R47.1 U11.2(-IN 1)
$1N24596: D9.2(A) D10.1(K) D22.2 R45.1 R49.2 R51.2
$1N24625: R46.2 R48.1 U11.3(+IN 1)
$1N24628: D11.2(A) D12.1(K) D22.1 R46.1 R50.1 R52.2
$1N25191: CN2.2 R51.1
$1N25197: CN2.3 R52.1
$1N25767: R53.1 R54.2 U12.2(REF)
$1N25827: R55.1 U12.1(CATHODE)
$1N25831: Q3.1(B) R55.2 R56.2
$1N25980: Q3.3(C) R57.2
$1N26057: Q4.1(B) R57.1 R58.2
$1N26425: C61.1 D14.1(C) Q5.1(B) R59.2
$1N26430: D13.1(C) D14.2(A)
$1N88546: U2.5(GATE) U18.1(G)
$2N689: L5.2 U13.2(LNA_IN)
$2N1443: Q6.5(B) R63.2
$2N1447: Q6.2(B) R62.1
$2N3594: C70.2 D15.2(A) D16.1(C)
$2N3835: C72.2 D17.2(A) D18.1(C)
$2N4117: C74.2 R66.1 U16.10(VREFIN/VREFOUT)
$2N7627: BUZZER1.2 D19.2(A) Q7.3(C)
$2N7859: Q7.1(B) R70.2
$2N8033: CN3.2 D20.2(A) Q8.3(D)
$2N8141: Q8.1(G) R71.2
$2N9883: Q9.1(B) R74.2
$2N11780: LED2.2(A) R76.1
$2N11784: LED3.2(A) R77.1
$2N29074: FPC1.10 Q9.3(C)

Not connected (* = marked no-connect by the designer): CN1 3 4; FPC1 7*; L5 1(ANT); U3 10(PG)*; U10 1(NC); U13 16(IO27) 22(IO2) 25(IO16)* 26(VDD_SDIO)* 27(IO17)* 30(CMD)* 31(CLK)* 32(SD0)* 33(SD1)* 44(XTAL_N_NC)* 45(XTAL_P_NC)* 47(CAP2_NC)* 48(CAP1_NC)*; U14 7(NC.)* 8(OUT#)* 9(CTS#)* 10(DSR#)* 11(RI#)* 12(DCD#)* 15(R232)*; USB1 A8(SUB1)* B8(SUB2)*

## Notes on the sheets
sheet 1
- NTC测温
- 电源输入
- PD20V
- 理想二极管
- vout *51/1051< 2.5v
  即 VOUT最高51V
- 9V电源
- 3.3V电源
- 输出过压保护电路
- 负电压产生电路
- 全桥升降压电路
- 输出滤波
- LM5175电路
- 电流采集电路
- 电流PI电路
- 电压采集/远端补偿
sheet 2
- 风扇/蜂鸣器
- ESP32最小系统
- ISP下载
- 输入电压检测
- 电压基准源
- 电荷泵电路
- 编码器按键
- DAC
- lcd 屏幕
